# EAGLE design Laser_Array_Temp_V1.2 (EAGLE 7.7.0)
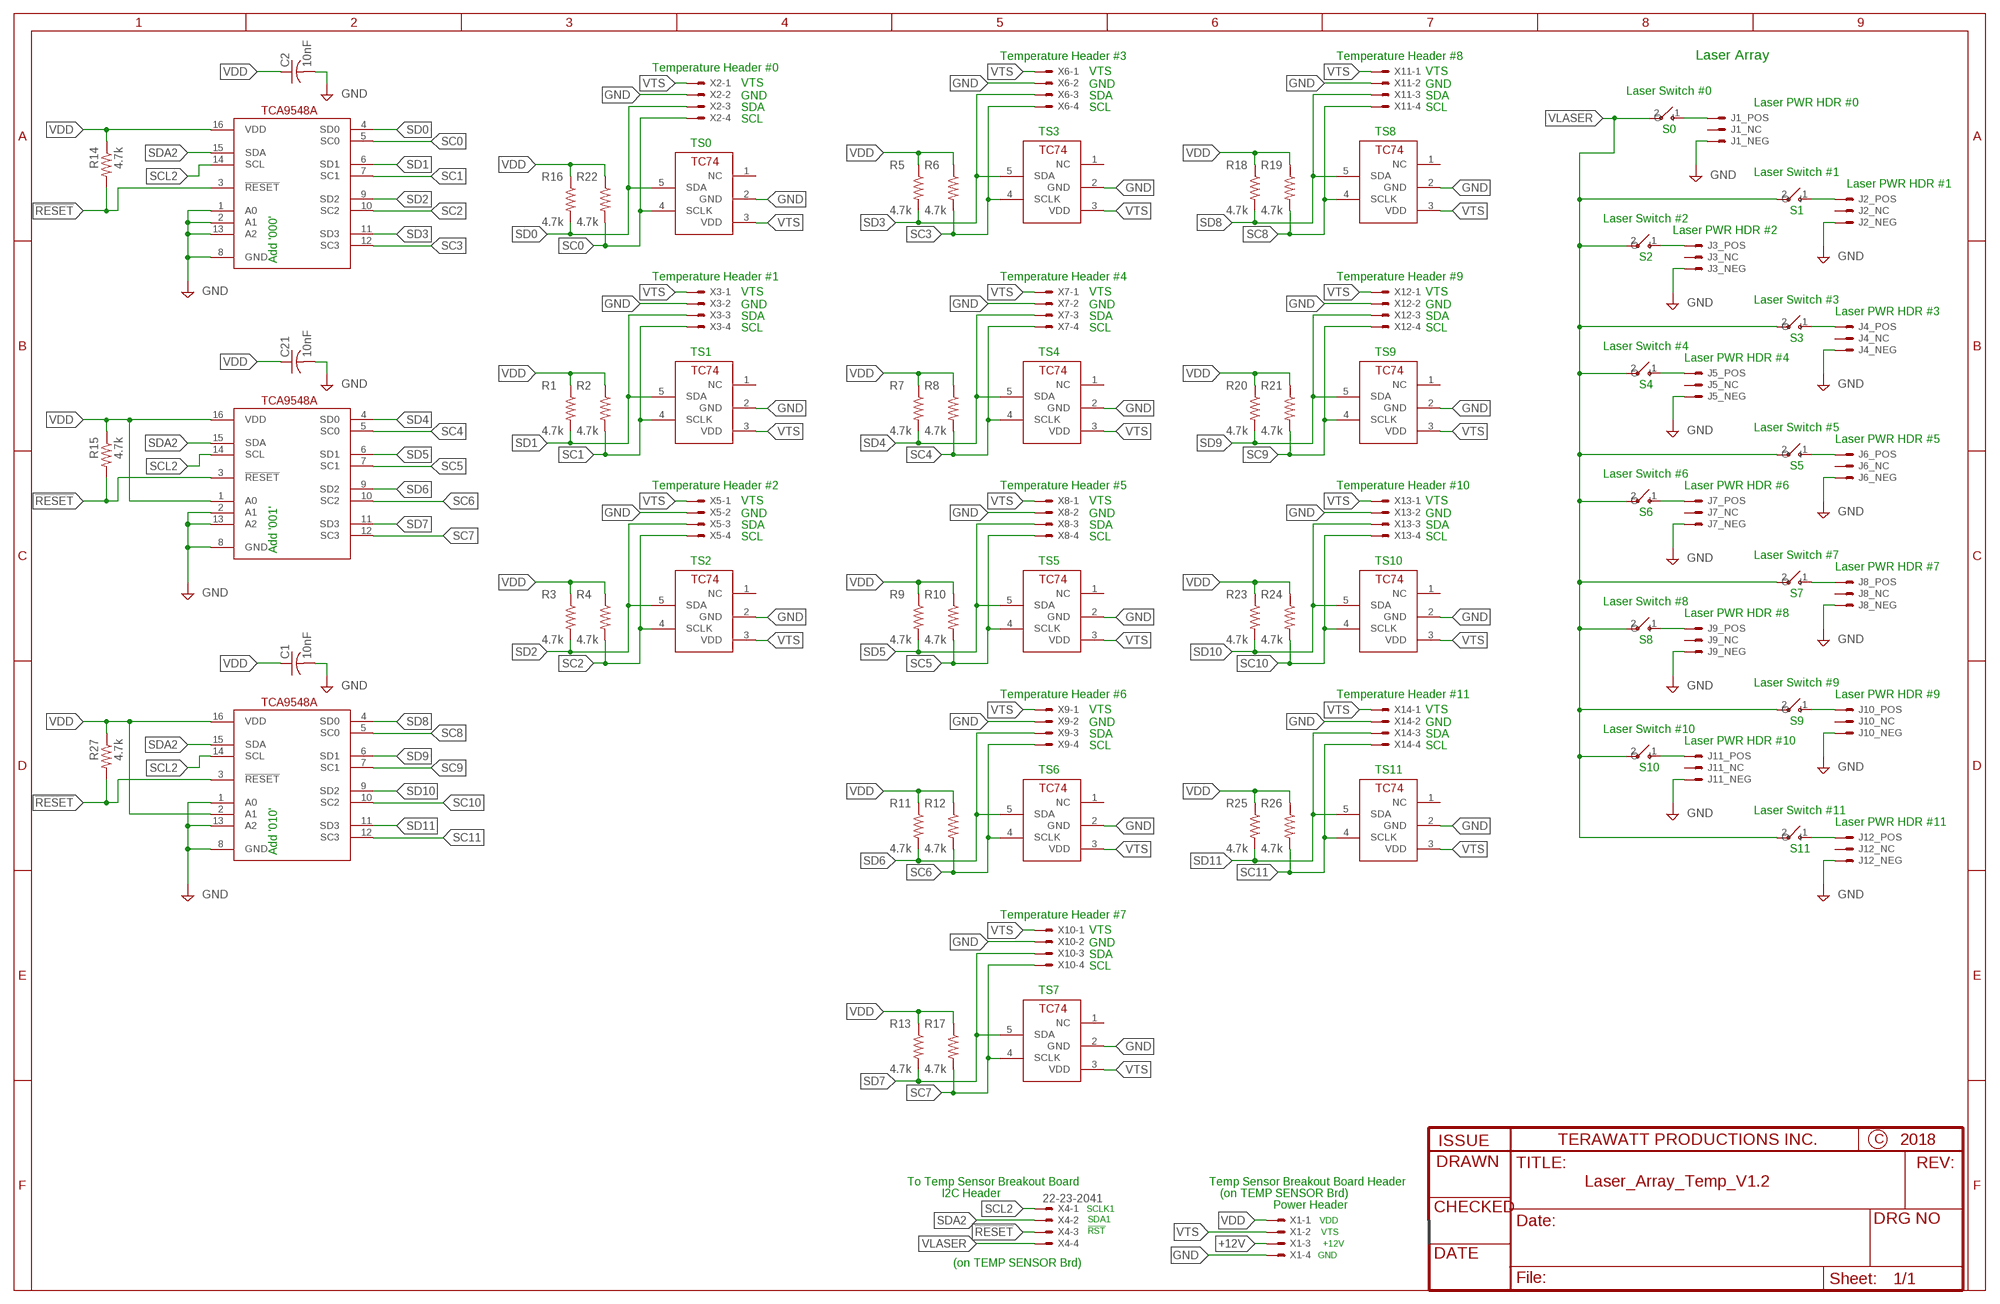
[diagram p0: schematic, sheet 1]

## Parts
C1  10nF  C-USC0805  [C0805]
C2  10nF  C-USC0805  [C0805]
C21  10nF  C-USC0805  [C0805]
J1  LASER_MOD  [LASER_MOD]
J2  LASER_MOD  [LASER_MOD]
J3  LASER_MOD  [LASER_MOD]
J4  LASER_MOD  [LASER_MOD]
J5  LASER_MOD  [LASER_MOD]
J6  LASER_MOD  [LASER_MOD]
J7  LASER_MOD  [LASER_MOD]
J8  LASER_MOD  [LASER_MOD]
J9  LASER_MOD  [LASER_MOD]
J10  LASER_MOD  [LASER_MOD]
J11  LASER_MOD  [LASER_MOD]
J12  LASER_MOD  [LASER_MOD]
R1  4.7k  R-US_M0805  [M0805]
R2  4.7k  R-US_M0805  [M0805]
R3  4.7k  R-US_M0805  [M0805]
R4  4.7k  R-US_M0805  [M0805]
R5  4.7k  R-US_M0805  [M0805]
R6  4.7k  R-US_M0805  [M0805]
R7  4.7k  R-US_M0805  [M0805]
R8  4.7k  R-US_M0805  [M0805]
R9  4.7k  R-US_M0805  [M0805]
R10  4.7k  R-US_M0805  [M0805]
R11  4.7k  R-US_M0805  [M0805]
R12  4.7k  R-US_M0805  [M0805]
R13  4.7k  R-US_M0805  [M0805]
R14  4.7k  R-US_M0805  [M0805]
R15  4.7k  R-US_M0805  [M0805]
R16  4.7k  R-US_M0805  [M0805]
R17  4.7k  R-US_M0805  [M0805]
R18  4.7k  R-US_M0805  [M0805]
R19  4.7k  R-US_M0805  [M0805]
R20  4.7k  R-US_M0805  [M0805]
R21  4.7k  R-US_M0805  [M0805]
R22  4.7k  R-US_M0805  [M0805]
R23  4.7k  R-US_M0805  [M0805]
R24  4.7k  R-US_M0805  [M0805]
R25  4.7k  R-US_M0805  [M0805]
R26  4.7k  R-US_M0805  [M0805]
R27  4.7k  R-US_M0805  [M0805]
S13  TOGGLE_SPST  [22-23-2021]
S14  TOGGLE_SPST  [22-23-2021]
S15  TOGGLE_SPST  [22-23-2021]
S16  TOGGLE_SPST  [22-23-2021]
S17  TOGGLE_SPST  [22-23-2021]
S18  TOGGLE_SPST  [22-23-2021]
S19  TOGGLE_SPST  [22-23-2021]
S20  TOGGLE_SPST  [22-23-2021]
S21  TOGGLE_SPST  [22-23-2021]
S22  TOGGLE_SPST  [22-23-2021]
S23  TOGGLE_SPST  [22-23-2021]
S24  TOGGLE_SPST  [22-23-2021]
TS1  TC74  [SOT23-5L]
TS2  TC74  [SOT23-5L]
TS3  TC74  [SOT23-5L]
TS4  TC74  [SOT23-5L]
TS5  TC74  [SOT23-5L]
TS6  TC74  [SOT23-5L]
TS7  TC74  [SOT23-5L]
TS8  TC74  [SOT23-5L]
TS9  TC74  [SOT23-5L]
TS10  TC74  [SOT23-5L]
TS11  TC74  [SOT23-5L]
TS12  TC74  [SOT23-5L]
U1  TCA9546A  [SOIC16N]
U2  TCA9546A  [SOIC16N]
U3  TCA9546A  [SOIC16N]
X1  22-23-2041  [22-23-2041]
X2  22-23-2041  [22-23-2041]
X3  22-23-2041  [22-23-2041]
X4  22-23-2041  [22-23-2041]
X5  22-23-2041  [22-23-2041]
X6  22-23-2041  [22-23-2041]
X7  22-23-2041  [22-23-2041]
X8  22-23-2041  [22-23-2041]
X9  22-23-2041  [22-23-2041]
X10  22-23-2041  [22-23-2041]
X11  22-23-2041  [22-23-2041]
X12  22-23-2041  [22-23-2041]
X13  22-23-2041  [22-23-2041]
X14  22-23-2041  [22-23-2041]

## Nets
!RESET: R14.2 R15.2 R27.2 U1.3(!RESET) U2.3(!RESET) U3.3(!RESET) X4.3
+12V: X1.3
GND: C1.2 C2.2 C21.2 J1.3 J2.3 J3.3 J4.3 J5.3 J6.3 J7.3 J8.3 J9.3 J10.3 J11.3 J12.3 TS1.2(GND) TS2.2(GND) TS3.2(GND) TS4.2(GND) TS5.2(GND) TS6.2(GND) TS7.2(GND) TS8.2(GND) TS9.2(GND) TS10.2(GND) TS11.2(GND) TS12.2(GND) U1.1(A0) U1.2(A1) U1.8(GND) U1.13(A2) U2.2(A1) U2.8(GND) U2.13(A2) U3.1(A0) U3.8(GND) U3.13(A2) X1.4 X2.2 X3.2 X5.2 X6.2 X7.2 X8.2 X9.2 X10.2 X11.2 X12.2 X13.2 X14.2
N$1: J2.1 S13.1(O)
N$2: J1.1 S16.1(O)
N$3: J3.1 S14.1(O)
N$4: J4.1 S15.1(O)
N$5: J5.1 S17.1(O)
N$6: J6.1 S18.1(O)
N$7: J7.1 S19.1(O)
N$8: J8.1 S20.1(O)
N$9: J9.1 S21.1(O)
N$10: J10.1 S22.1(O)
N$11: J11.1 S23.1(O)
N$12: J12.1 S24.1(O)
SC0: R22.2 TS1.4(SCLK) U1.5(SC0) X2.4
SC1: R2.2 TS2.4(SCLK) U1.7(SC1) X3.4
SC2: R4.2 TS3.4(SCLK) U1.10(SC2) X5.4
SC3: R6.2 TS4.4(SCLK) U1.12(SC3) X6.4
SC4: R8.2 TS5.4(SCLK) U2.5(SC0) X7.4
SC5: R10.2 TS6.4(SCLK) U2.7(SC1) X8.4
SC6: R12.2 TS7.4(SCLK) U2.10(SC2) X9.4
SC7: R17.2 TS8.4(SCLK) U2.12(SC3) X10.4
SC8: R19.2 TS9.4(SCLK) U3.5(SC0) X11.4
SC9: R21.2 TS10.4(SCLK) U3.7(SC1) X12.4
SC10: R24.2 TS11.4(SCLK) U3.10(SC2) X13.4
SC11: R26.2 TS12.4(SCLK) U3.12(SC3) X14.4
SCL2: U1.14(SCL) U2.14(SCL) U3.14(SCL) X4.1
SD0: R16.2 TS1.5(SDA) U1.4(SD0) X2.3
SD1: R1.2 TS2.5(SDA) U1.6(SD1) X3.3
SD2: R3.2 TS3.5(SDA) U1.9(SD2) X5.3
SD3: R5.2 TS4.5(SDA) U1.11(SD3) X6.3
SD4: R7.2 TS5.5(SDA) U2.4(SD0) X7.3
SD5: R9.2 TS6.5(SDA) U2.6(SD1) X8.3
SD6: R11.2 TS7.5(SDA) U2.9(SD2) X9.3
SD7: R13.2 TS8.5(SDA) U2.11(SD3) X10.3
SD8: R18.2 TS9.5(SDA) U3.4(SD0) X11.3
SD9: R20.2 TS10.5(SDA) U3.6(SD1) X12.3
SD10: R23.2 TS11.5(SDA) U3.9(SD2) X13.3
SD11: R25.2 TS12.5(SDA) U3.11(SD3) X14.3
SDA2: U1.15(SDA) U2.15(SDA) U3.15(SDA) X4.2
VDD: C1.1 C2.1 C21.1 R1.1 R2.1 R3.1 R4.1 R5.1 R6.1 R7.1 R8.1 R9.1 R10.1 R11.1 R12.1 R13.1 R14.1 R15.1 R16.1 R17.1 R18.1 R19.1 R20.1 R21.1 R22.1 R23.1 R24.1 R25.1 R26.1 R27.1 U1.16(VDD) U2.1(A0) U2.16(VDD) U3.2(A1) U3.16(VDD) X1.1
VLASER: S13.2(I) S14.2(I) S15.2(I) S16.2(I) S17.2(I) S18.2(I) S19.2(I) S20.2(I) S21.2(I) S22.2(I) S23.2(I) S24.2(I) X4.4
VTS: TS1.3(VDD) TS2.3(VDD) TS3.3(VDD) TS4.3(VDD) TS5.3(VDD) TS6.3(VDD) TS7.3(VDD) TS8.3(VDD) TS9.3(VDD) TS10.3(VDD) TS11.3(VDD) TS12.3(VDD) X1.2 X2.1 X3.1 X5.1 X6.1 X7.1 X8.1 X9.1 X10.1 X11.1 X12.1 X13.1 X14.1
Unconnected: J1.2 J2.2 J3.2 J4.2 J5.2 J6.2 J7.2 J8.2 J9.2 J10.2 J11.2 J12.2 TS1.1(NC) TS2.1(NC) TS3.1(NC) TS4.1(NC) TS5.1(NC) TS6.1(NC) TS7.1(NC) TS8.1(NC) TS9.1(NC) TS10.1(NC) TS11.1(NC) TS12.1(NC)

## Notes on the sheet
- Temperature Header #3 | Temperature Header #8 | Laser Array
- Temperature Header #0
- VTS | VTS
- VTS | GND | GND
- Laser Switch #0
- GND | SDA | SDA
- Laser PWR HDR #0
- SDA | SCL | SCL
- SCL
- TS3 | TS8 | S0
- TS0
- Laser Switch #1
- Laser PWR HDR #1
- S1
- Laser Switch #2
- Laser PWR HDR #2
- Add '000' | S2
- Temperature Header #1 | Temperature Header #4 | Temperature Header #9
- VTS | VTS | VTS
- Laser Switch #3
- GND | GND | GND
- Laser PWR HDR #3
- SDA | SDA | SDA
- SCL | SCL | SCL
- S3
- Laser Switch #4
- TS1 | TS4 | TS9
- Laser PWR HDR #4
- S4
- Laser Switch #5
- Laser PWR HDR #5
- S5
- Laser Switch #6
- Temperature Header #2 | Temperature Header #5 | Temperature Header #10 | Laser PWR HDR #6
- VTS | VTS | VTS
- GND | GND | GND | S6
- SDA | SDA | SDA
- SCL | SCL | SCL
- Add '001'
- Laser Switch #7
- TS2 | TS5 | TS10
- Laser PWR HDR #7
- S7
- Laser Switch #8
- Laser PWR HDR #8
- S8
- Laser Switch #9
- Temperature Header #6 | Temperature Header #11 | Laser PWR HDR #9
- VTS | VTS
- GND | GND | S9
- Laser Switch #10
- SDA | SDA
- Laser PWR HDR #10
- SCL | SCL
- TS6 | TS11 | S10
- Laser Switch #11
- Laser PWR HDR #11
- Add '010' | S11
- Temperature Header #7
- VTS
- GND
- SDA
- SCL
- TS7
- To Temp Sensor Breakout Board | Temp Sensor Breakout Board Header
- I2C Header | (on TEMP SENSOR Brd)
- Power Header
- SCLK1
- SDA1 | VDD
- !RST | VTS
- +12V
- GND
- (on TEMP SENSOR Brd)

## Library data of the parts
C1 C2 C21 = rcl:C-US: CAPACITOR, American symbol
J1-J12 = Mine:LASER_MOD
R1-R27 = rcl:R-US_: RESISTOR, American symbol
S13-S24 = Mine:TOGGLE_SPST: SPST Toggle SPST toggle switch with no package
TS1-TS12 = Mine:TC74
U1-U3 = Mine:TCA9546A
X1-X14 = Mine:22-23-2041: .100" (2.54mm) Center Header - 4 Pin; MF: MOLEX; MPN: 22-23-2041; OC_FARNELL: 1462920; OC_NEWARK: 38C0355

## Net classes
0 default: width 0.254 mm, drill 0.508 mm, clearance 0.203 mm

## Board
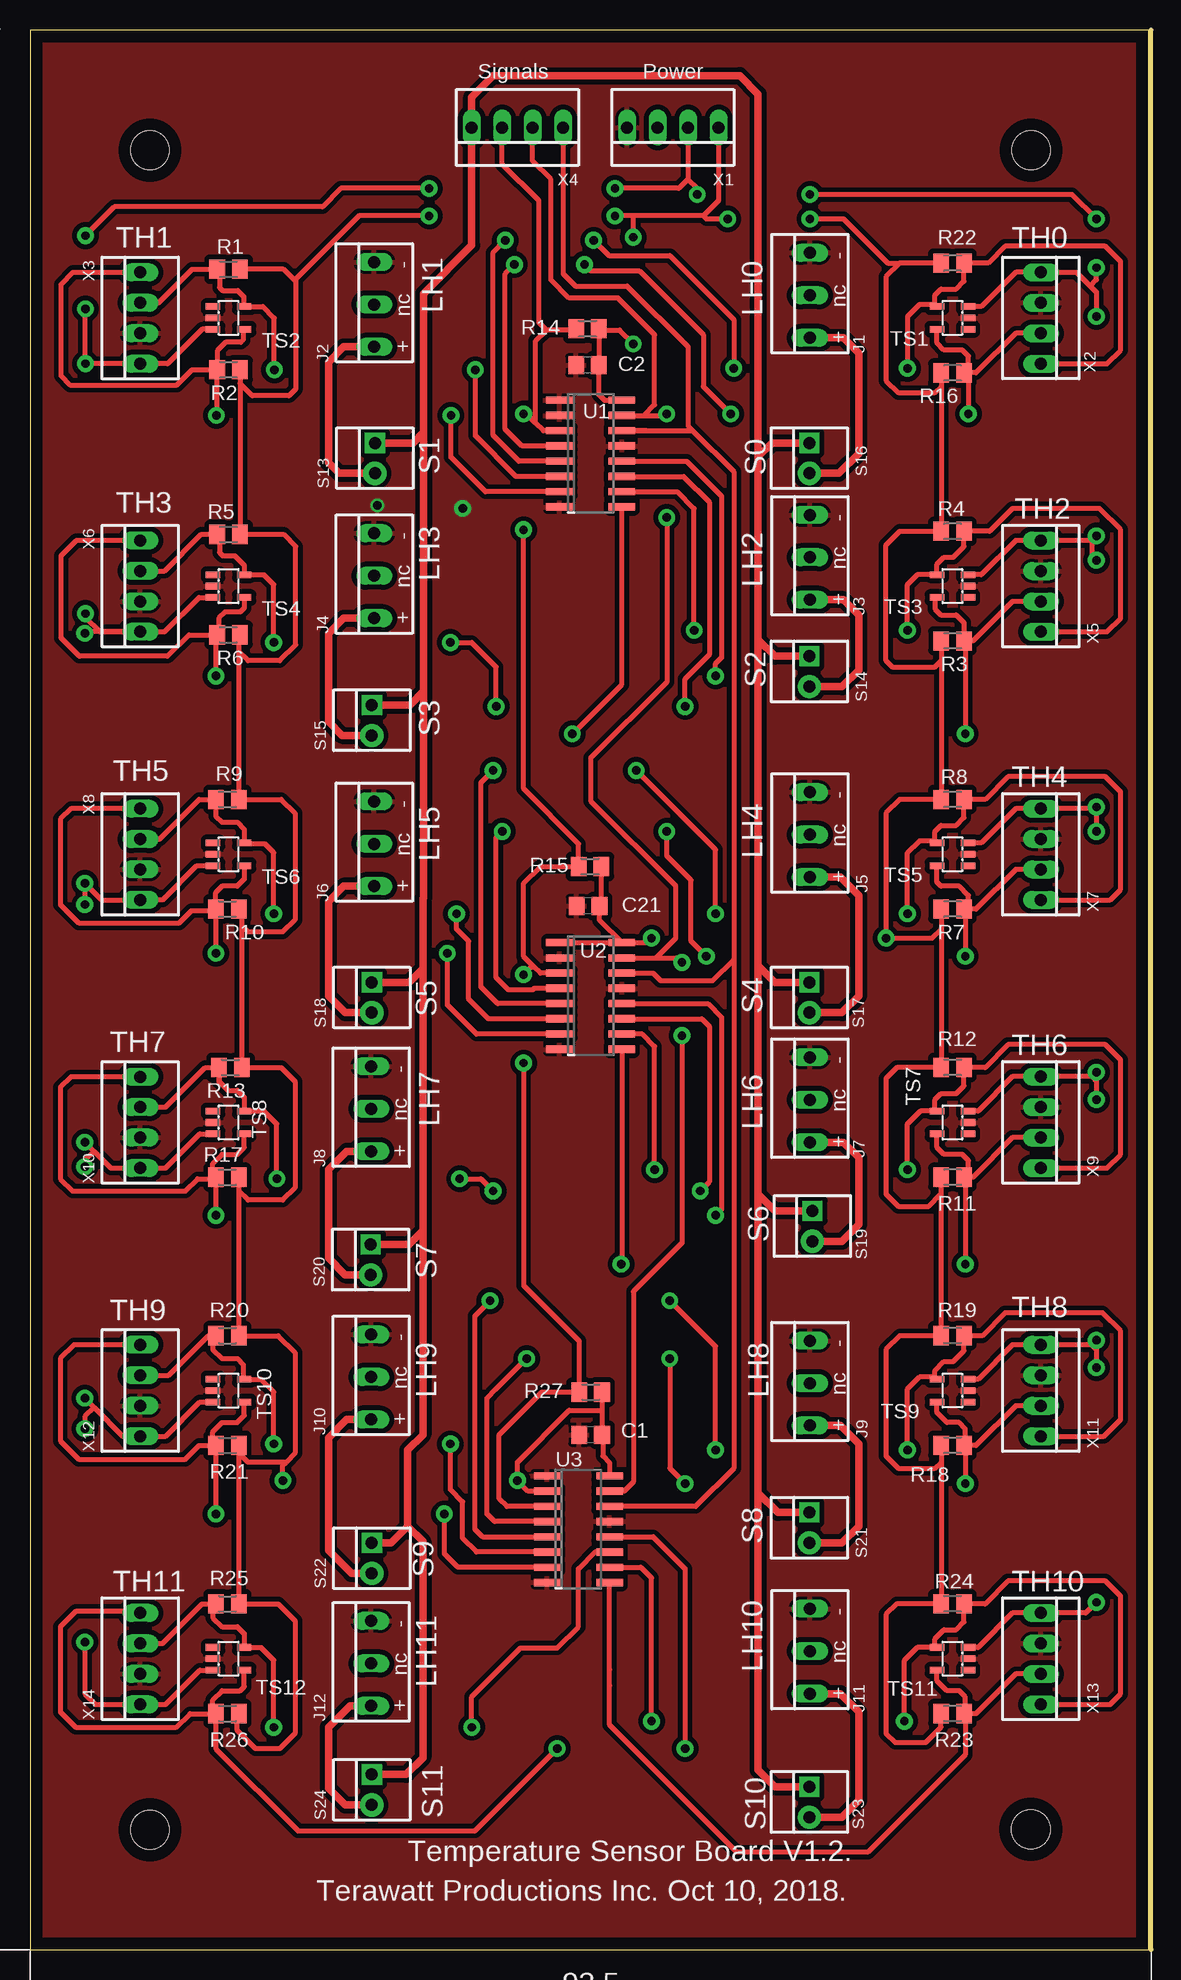
[diagram p1: board, top side]
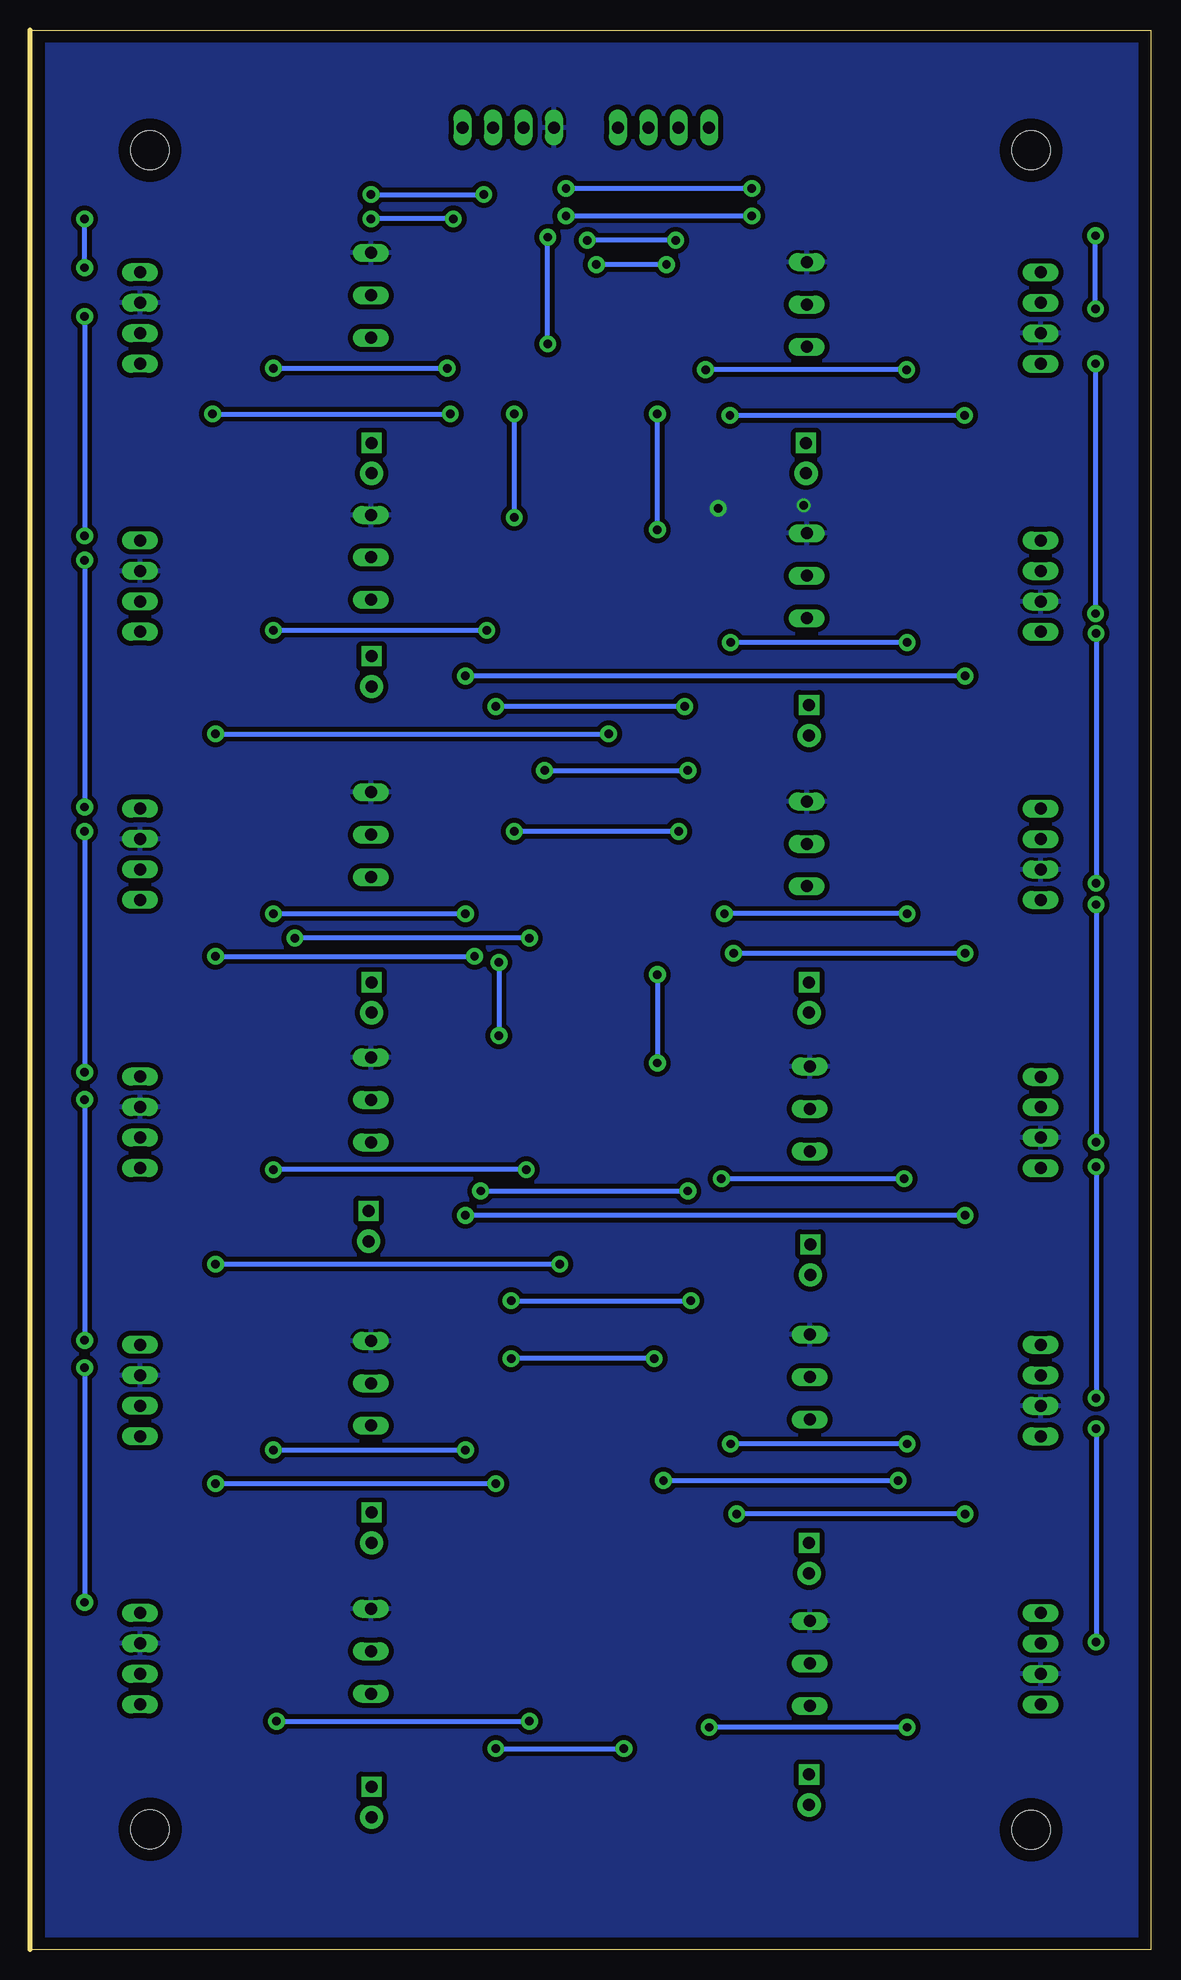
[diagram p2: board, bottom side, seen from below]

Size 93.45 x 160.02 mm. Coordinates in mm from the lower left corner, seen from the top.
Outline: 0,0 93.45,0 93.45,160.02 0,160.02 0,0
Copper layers (1*16): Top 0.035mm / dielectric 1.5mm / Bottom 0.035mm
Design rules "default *": minimum track width 10mil, minimum drill 24mil, track to track 16mil, track to pad 14mil, pad to pad 14mil, via to via 14mil, smd to smd 14mil, copper to edge 40mil, drill to drill 8mil, minimum pad ring 10mil, minimum via ring 8mil, stop-mask expansion 4mil, vias tented up to drill 0mil, thermal gap 10mil
Holes 3.2 mm at 10,10 10,150 83.44,10.04 83.46,150

### Footprints (pad centres in the part's own frame; a part is rotated, then mirrored left to right if it is on the bottom)
C0805 = smd 1.3 x 1.5: 1 -0.95,0; 2 0.95,0
LASER_MOD = drill 1 long: 1 -2.54,0; 2 1,0; 3 4.54,0
M0805 = smd 1.3 x 1.6: 1 -0.95,0; 2 0.95,0
22-23-2021 = drill 1 pad 1.93: 1 -1.27,0 | drill 1 pad 1.676 square: 2 1.27,0
SOT23-5L = smd 0.55 x 1.2: 1 -0.95,-1.3; 2 0,-1.3; 3 0.95,-1.3; 4 0.95,1.3; 5 -0.95,1.3
SOIC16N = smd 0.6 x 2.2: 1 -4.445,-2.6; 2 -3.175,-2.6; 3 -1.905,-2.6; 4 -0.635,-2.6; 5 0.635,-2.6; 6 1.905,-2.6; 7 3.175,-2.6; 8 4.445,-2.6; 9 4.445,2.6; 10 3.175,2.6; 11 1.905,2.6; 12 0.635,2.6; 13 -0.635,2.6; 14 -1.905,2.6; 15 -3.175,2.6; 16 -4.445,2.6
22-23-2041 = drill 1 long: 1 -3.81,0; 2 -1.27,0; 3 1.27,0; 4 3.81,0

### Placement (x,y rotation side)
C1  46.74,42.93 180 top
C2  46.48,132.08 180 top
C21  46.53,86.99 180 top
J1  65.02,136.91 90 top
J2  28.7,136.14 90 top
J3  65.02,115.06 90 top
J4  28.7,113.54 90 top
J5  65.02,91.95 90 top
J6  28.7,91.19 90 top
J7  65.02,69.85 90 top
J8  28.45,69.09 90 top
J9  65.02,46.23 90 top
J10  28.45,46.74 90 top
J11  65.02,23.88 90 top
J12  28.45,22.86 90 top
R1  16.56,140.08 180 top
R2  16.56,131.7 180 top
R3  76.91,109.09 0 top
R4  76.91,118.24 0 top
R5  16.56,117.98 180 top
R6  16.56,109.6 180 top
R7  76.91,86.74 0 top
R8  76.91,95.89 0 top
R9  16.46,95.89 180 top
R10  16.46,86.74 180 top
R11  76.91,64.39 0 top
R12  76.91,73.53 0 top
R13  16.72,73.53 180 top
R14  46.48,135.13 180 top
R15  46.69,90.3 180 top
R16  76.91,131.44 0 top
R17  16.46,64.39 180 top
R18  76.91,42.04 0 top
R19  76.91,51.18 0 top
R20  16.46,51.18 180 top
R21  16.46,42.04 180 top
R22  76.91,140.59 0 top
R23  76.91,19.68 0 top
R24  76.91,28.83 0 top
R25  16.46,28.83 180 top
R26  16.46,19.69 180 top
R27  46.74,46.48 180 top
S13  28.75,124.33 90 top
S14  64.97,106.55 90 top
S15  28.5,102.49 90 top
S16  64.97,124.33 90 top
S17  64.97,79.38 90 top
S18  28.5,79.37 90 top
S19  65.23,60.33 90 top
S20  28.4,57.53 90 top
S21  64.97,35.18 90 top
S22  28.5,32.64 90 top
S23  64.97,12.32 90 top
S24  28.5,13.33 90 top
TS1  76.91,136.02 90 top
TS2  16.56,136.02 270 top
TS3  76.91,113.67 90 top
TS4  16.56,113.66 270 top
TS5  76.91,91.31 90 top
TS6  16.56,91.31 270 top
TS7  76.91,68.96 90 top
TS8  16.56,68.96 270 top
TS9  76.91,46.61 90 top
TS10  16.56,46.61 270 top
TS11  76.91,24.26 90 top
TS12  16.56,24.26 270 top
U1  46.74,124.71 270 top
U2  46.74,79.5 270 top
U3  45.72,35.05 270 top
X1  53.59,151.89 180 top
X2  84.28,136.02 270 top
X3  9.19,136.02 90 top
X4  40.64,151.89 180 top
X5  84.28,113.67 270 top
X6  9.19,113.66 90 top
X7  84.28,91.31 270 top
X8  9.19,91.31 90 top
X9  84.28,68.96 270 top
X10  9.19,68.96 90 top
X11  84.28,46.61 270 top
X12  9.19,46.61 90 top
X13  84.28,24.26 270 top
X14  9.19,24.26 90 top

### Tracks (layer width: path | path; a pad name or v marks a point on that pad's centre or on a via)
!RESET  (via drill 0.7 pad 1.4)
  Top 0.406: U1.3 42.8,126.62 42.16,127.25 | 42.16,127.25 42.16,134.11 43.05,135 | R14.2 45.41,135 43.05,135 | 42.16,127.25 41.4,128.02 v41.15,128.02 | 43.05,135 42.42,135.64 42.42,145.8 39.37,148.84 X4.3 | U2.3 42.55,81.41 42.04,81.92 | 42.04,81.92 41.15,82.8 41.15,88.9 42.55,90.3 R15.2 45.74,92.18 41.15,96.77 v41.15,118.36 | v41.15,73.91 41.15,55.37 45.79,50.73 R27.2 42.67,46.48 39.12,42.93 39.12,37.59 39.75,36.96 U3.3 | v41.15,81.28 41.78,81.92 42.04,81.92
  Bottom 0.406: v41.15,118.36 v41.15,128.02 | v41.15,81.28 v41.15,73.91
GND  (via drill 0.7, 0.7 pad 1.4)
  other vias: 28.96,120.4 36.07,120.14
  pour Top: 0,160.1 93.47,159.84 93.47,-0.25 0,0
  pour Bottom: 0,160.1 94.23,159.84 94.23,-0.25 0.25,0
N$1
  Top 0.61: S13.1 25.78,123.06 24.89,123.95 24.89,132.33 26.16,133.6 J2.1
N$2
  Top 0.61: S16.1 67.44,123.06 69.09,124.71 69.09,133.1 67.82,134.37 J1.1
N$3
  Top 0.61: S14.1 67.69,105.28 69.09,106.68 69.09,111.25 67.82,112.52 J3.1
N$4
  Top 0.61: S15.1 26.04,101.22 24.89,102.36 24.89,109.73 26.16,111 J4.1
N$5
  Top 0.61: S17.1 67.69,78.11 69.09,79.5 69.09,87.88 67.56,89.41 J5.1
N$6
  Top 0.61: S18.1 26.29,78.1 24.89,79.5 24.89,87.38 26.16,88.65 J6.1
N$7
  Top 0.61: S19.1 67.69,59.05 69.09,60.45 69.09,66.04 67.82,67.31 J7.1
N$8
  Top 0.61: S20.1 26.29,56.26 24.89,57.66 24.89,65.02 26.42,66.55 J8.1
N$9
  Top 0.61: S21.1 67.69,33.91 69.09,35.31 69.09,42.16 67.56,43.69 J9.1
N$10
  Top 0.61: S22.1 26.8,31.37 24.89,33.27 24.89,42.67 26.42,44.2 J10.1
N$11
  Top 0.61: S23.1 67.69,11.05 69.09,12.45 69.09,19.81 67.56,21.34 J11.1
N$12
  Top 0.61: S24.1 26.29,12.06 24.89,13.46 24.89,18.54 26.67,20.32 J12.1
SC0  (via drill 0.7 pad 1.4)
  Top 0.406: TS1.4 75.44,137.14 | 75.44,137.14 75.44,137.92 75.95,138.43 77.22,138.43 77.86,139.07 R22.2 79.88,140.59 81.28,141.99 89.66,141.99 90.93,140.72 90.93,133.35 89.79,132.21 X2.4 | 75.44,137.14 74.15,137.14 73.15,136.14 v73.15,131.83 | U1.5 40.77,124.08 38.61,126.24 38.61,141.48 v39.62,142.49 | v46.99,142.49 48.26,141.22 53.34,141.22 58.67,135.89 v58.67,131.83
  Bottom 0.406: v73.15,131.83 v58.67,131.83 | v39.62,142.49 v46.99,142.49
SC1  (via drill 0.7 pad 1.4)
  Top 0.406: TS2.4 17.76,134.97 17.76,134.17 17.57,133.98 16.3,133.98 15.61,133.29 R2.2 | R2.2 15.8,131.76 15.54,131.51 v15.54,127.89 | X3.4 3.6,139.83 2.59,138.81 2.59,131.19 3.35,130.43 12.24,130.43 13.51,131.7 R2.2 | U1.7 37.97,121.54 35.1,124.41 v35.1,127.89
  Bottom 0.406: v15.54,127.89 v35.1,127.89
SC2  (via drill 0.7 pad 1.4)
  Top 0.406: X5.4 89.79,109.86 90.93,111 90.93,118.36 89.15,120.14 81.92,120.14 80.01,118.24 R4.2 77.86,116.98 76.96,116.08 76.2,116.08 75.61,115.49 TS3.4 73.97,114.61 73.15,113.79 v73.15,109.98 | U1.10 53.98,121.54 55.37,120.14 v55.37,109.98
  Bottom 0.406: v73.15,109.98 v55.37,109.98
SC3  (via drill 0.7 pad 1.4)
  Top 0.406: X6.4 3.86,117.47 2.59,116.2 2.59,109.35 4.11,107.82 11.48,107.82 13.26,109.6 R6.2 15.75,109.74 | 15.75,109.74 15.75,111 16.26,111.51 17.53,111.51 17.86,111.84 TS4.4 | 15.75,109.74 15.75,109.22 15.49,108.97 v15.49,106.17 | U1.12 54.74,124.08 57.66,121.16 57.66,107.7 57.15,107.19 v57.15,106.17
  Bottom 0.406: v15.49,106.17 v57.15,106.17
SC4  (via drill 0.7 pad 1.4)
  Top 0.406: TS5.4 75.44,92.44 | 75.44,92.44 75.44,93.22 75.95,93.73 77.22,93.73 77.86,94.37 R8.2 79.63,95.89 81.53,97.79 89.66,97.79 90.93,96.52 90.93,88.39 90.04,87.5 X7.4 | 75.44,92.44 74.15,92.44 73.15,91.44 v73.15,86.36 | U2.5 38.99,78.87 37.59,80.26 37.59,97.28 v38.61,98.3 | 50.55,98.04 v50.55,98.3 57.15,91.69 v57.15,86.36
  Bottom 0.406: v73.15,86.36 v57.15,86.36 | v50.55,98.3 v38.61,98.3
SC5  (via drill 0.7 pad 1.4)
  Top 0.406: X8.4 3.43,95.12 2.54,94.23 2.54,87.12 4.06,85.6 12.45,85.6 13.46,86.61 15.38,86.61 R10.2 15.49,86.76 | 15.49,86.76 15.49,88.14 16,88.65 17.27,88.65 17.86,89.23 TS6.4 | 15.49,86.76 v15.49,83.06 | U2.7 37.21,76.33 34.8,78.74 v34.8,83.06
  Bottom 0.406: v15.49,83.06 v34.8,83.06
SC6  (via drill 0.7 pad 1.4)
  Top 0.406: X9.4 89.79,65.15 90.93,66.29 90.93,74.17 89.66,75.44 81.53,75.44 79.63,73.53 R12.2 77.86,72.02 77.22,71.37 75.95,71.37 75.44,70.87 75.44,70.08 TS7.4 74.23,69.91 73.15,68.83 v73.15,65.02 | U2.10 51.05,76.33 52.07,75.31 v52.07,65.02
  Bottom 0.406: v52.07,65.02 v73.15,65.02
SC7  (via drill 0.7 pad 1.4)
  Top 0.406: X10.4 3.43,72.77 2.54,71.88 2.54,64.26 3.56,63.25 12.95,63.25 13.97,64.26 15.38,64.26 R17.2 | R17.2 15.24,64.66 15.24,65.53 16,66.29 17.27,66.29 17.86,66.88 TS8.4 | R17.2 15.49,64.37 v15.49,61.21 | U2.12 56.52,78.87 57.66,77.72 57.66,61.72 v57.15,61.21
  Bottom 0.406: v15.49,61.21 v57.15,61.21
SC8  (via drill 0.7 pad 1.4)
  Top 0.406: TS9.4 75.44,47.73 | 75.44,47.73 75.44,48.26 76.2,49.02 76.96,49.02 77.86,49.92 R19.2 79.38,51.18 81.28,53.09 89.41,53.09 90.93,51.56 90.93,44.2 89.53,42.8 X11.4 | 75.44,47.73 74.15,47.73 73.15,46.74 v73.15,41.66 | v53.34,54.1 57.15,50.29 v57.15,41.66 | U3.5 37.72,34.42 37.08,35.05 37.08,52.83 v38.35,54.1
  Bottom 0.406: v73.15,41.66 v57.15,41.66 | v53.34,54.1 v38.35,54.1
SC9  (via drill 0.7 pad 1.4)
  Top 0.406: X12.4 3.68,50.42 2.54,49.28 2.54,42.42 4.06,40.89 12.95,40.89 14.1,42.04 R21.2 | R21.2 15.24,42.31 15.24,43.18 16,43.94 17.27,43.94 17.86,44.53 TS10.4 | R21.2 15.49,42.02 v15.49,36.32 | U3.7 35.69,31.88 34.54,33.02 v34.54,36.32
  Bottom 0.406: v15.49,36.32 v34.54,36.32
SC10  (via drill 0.7 pad 1.4)
  Top 0.406: X13.4 90.04,20.45 90.93,21.34 90.93,29.46 89.66,30.73 81.53,30.73 79.63,28.83 R24.2 77.86,27.32 77.22,26.67 76.2,26.67 75.44,25.91 75.44,25.38 TS11.4 73.97,25.21 72.9,24.13 v72.9,19.05 | U3.10 50.93,31.88 51.82,30.99 v51.82,19.05
  Bottom 0.406: v72.9,19.05 v51.82,19.05
SC11  (via drill 0.7 pad 1.4)
  Top 0.406: X14.4 9.06,28.19 3.81,28.19 2.54,26.92 2.54,19.81 3.81,18.54 12.19,18.54 13.34,19.69 R26.2 | R26.2 15.24,19.96 15.24,20.83 16,21.59 17.53,21.59 17.86,21.92 TS12.4 | R26.2 15.49,19.67 15.49,16.76 22.35,9.91 37.08,9.91 v43.94,16.76 | U3.12 51.94,34.42 54.61,31.75 v54.61,16.76
  Bottom 0.406: v54.61,16.76 v43.94,16.76
SCL2
  Top 0.406: X4.1 44.45,139.7 45.47,138.68 49.78,138.68 54.86,133.6 54.86,127 55.24,126.62 | 51.44,126.62 U1.14 55.24,126.62 | 55.24,126.62 58.67,123.19 58.67,82.55 | U2.14 51.94,81.41 52.58,80.77 56.9,80.77 58.67,82.55 | 58.67,82.55 58.67,40.13 55.5,36.96 U3.14
SD0  (via drill 0.7 pad 1.4)
  Top 0.406: R16.2 78.23,131.82 78.23,132.84 77.72,133.35 76.2,133.35 75.61,133.94 TS1.5 | X2.3 82.17,134.75 78.87,131.44 R16.2 | R16.2 78.23,131.07 v78.23,128.02 | U1.4 41.02,125.35 39.62,126.75 39.62,139.7 v40.39,140.46 | v58.42,128.02 56.13,130.3 56.13,134.62 50.8,139.95 46.74,139.95 v46.23,140.46
  Bottom 0.406: v78.23,128.02 v58.42,128.02 | v40.39,140.46 v46.23,140.46
SD1  (via drill 0.7 pad 1.4)
  Top 0.406: X3.3 10.72,137.29 13.51,140.08 R1.2 15.8,139.89 15.8,138.56 16.05,138.3 17.32,138.3 17.83,137.79 17.83,137 TS2.5 19.42,136.97 20.37,136.02 v20.37,131.7 | U1.6 40.51,122.81 37.13,126.19 v37.13,131.7
  Bottom 0.406: v20.37,131.7 v37.13,131.7
SD2  (via drill 0.7 pad 1.4)
  Top 0.406: X5.3 81.92,112.39 78.61,109.09 R3.2 | TS3.5 75.44,112.54 75.44,111.76 75.95,111.25 77.22,111.25 77.86,110.61 R3.2 | R3.2 77.98,108.98 v77.98,101.35 | U1.9 49.34,105.92 49.34,105.72 49.34,105.47 v45.21,101.35
  Bottom 0.406: v77.98,101.35 v45.21,101.35
SD3  (via drill 0.7 pad 1.4)
  Top 0.406: X6.3 11.22,114.93 14.27,117.98 R5.2 16.05,117.66 15.8,117.41 15.8,116.46 16.05,116.2 17.07,116.2 17.86,115.41 TS4.5 19.5,114.61 20.32,113.79 v20.32,108.97 | U1.11 54.48,122.81 56.64,120.65 56.64,107.95 54.61,105.92 v54.61,103.63 | v38.86,103.63 38.86,106.93 36.83,108.97 v35.05,108.97
  Bottom 0.406: v20.32,108.97 v35.05,108.97 | v38.86,103.63 v54.61,103.63
SD4  (via drill 0.7 pad 1.4)
  Top 0.406: X7.3 82.17,90.04 78.87,86.74 R7.2 | R7.2 78.23,87.11 78.23,87.88 77.47,88.65 75.95,88.65 75.61,88.98 TS5.5 | R7.2 77.98,86.62 v77.98,82.8 | U2.4 42.04,80.14 41.91,80.01 39.88,80.01 38.86,81.03 38.86,92.71 v39.37,93.22 | v56.39,82.8 55.12,84.07 55.12,89.15 53.09,91.19 v53.09,93.22
  Bottom 0.406: v77.98,82.8 v56.39,82.8 | v39.37,93.22 v53.09,93.22
SD5  (via drill 0.7 pad 1.4)
  Top 0.406: X8.3 10.79,92.58 14.1,95.89 R9.2 15.49,95.87 15.49,94.49 16,93.98 17.27,93.98 17.86,93.39 17.86,92.28 | 17.86,92.28 TS6.5 | 17.86,92.28 17.78,92.2 19.56,92.2 20.32,91.44 v20.32,86.36 | U2.6 38.23,77.6 36.58,79.25 36.58,84.07 35.56,85.09 v35.56,86.36
  Bottom 0.406: v20.32,86.36 v35.56,86.36
SD6  (via drill 0.7 pad 1.4)
  Top 0.406: R11.2 78.23,64.76 78.23,65.79 77.72,66.29 76.2,66.29 75.61,66.88 TS7.5 | X9.3 81.92,67.69 78.61,64.39 R11.2 | R11.2 77.98,64.27 v77.98,57.15 | U2.9 49.34,57.21 v49.28,57.15
  Bottom 0.406: v77.98,57.15 v49.28,57.15
SD7  (via drill 0.7 pad 1.4)
  Top 0.406: X10.3 11.3,70.23 14.61,73.53 R13.2 | R13.2 15.75,73.52 15.75,72.39 15.77,72.37 | R13.2 15.77,72.37 | 15.77,72.37 16.51,71.63 17.27,71.63 17.86,71.04 TS8.5 19.5,69.91 20.57,68.83 v20.57,64.26 | U2.11 56.01,77.6 56.64,76.96 56.64,64.01 v55.88,63.25 | v35.81,64.26 37.59,64.26 v38.61,63.25
  Bottom 0.406: v20.57,64.26 v35.81,64.26 | v55.88,63.25 v38.61,63.25
SD8  (via drill 0.7 pad 1.4)
  Top 0.406: R18.2 77.98,42.15 77.98,43.43 77.47,43.94 76.45,43.94 75.61,44.78 TS9.5 | X11.3 82.17,45.34 78.87,42.04 R18.2 | R18.2 77.98,41.92 v77.98,38.86 | U3.4 38.73,35.69 38.1,36.32 38.1,45.97 38.86,46.74 39.62,47.5 v41.4,49.28 | v53.34,49.28 53.34,40.13 v54.61,38.86
  Bottom 0.406: v77.98,38.86 v54.61,38.86 | v41.4,49.28 v53.34,49.28
SD9  (via drill 0.7 pad 1.4)
  Top 0.406: X12.3 11.56,47.88 14.86,51.18 R20.2 15.24,50.91 15.24,50.04 16,49.28 17.27,49.28 17.78,48.77 17.78,47.64 TS10.5 19.24,47.56 20.32,46.48 v20.32,42.16 | U3.6 37.21,33.15 36.07,34.29 36.07,37.34 35.05,38.35 v35.05,42.16
  Bottom 0.406: v20.32,42.16 v35.05,42.16
SD10
  Top 0.406: R23.2 77.98,19.8 77.98,21.08 77.47,21.59 76.45,21.59 75.61,22.43 TS11.5 | X13.3 82.17,22.99 78.87,19.68 R23.2 | R23.2 77.98,19.57 77.98,16.26 69.85,8.13 58.93,8.13 48.32,18.74 48.32,22.04 48.32,23.37 U3.9
SD11  (via drill 0.7 pad 1.4)
  Top 0.406: X14.3 11.05,25.53 14.35,28.83 R25.2 15.24,28.56 15.24,27.69 16,26.92 17.27,26.92 17.86,26.34 TS12.5 19.24,25.21 20.32,24.13 v20.32,18.54 | U3.11 47.12,33.15 45.72,31.75 45.72,26.92 43.94,25.15 40.89,25.15 36.83,21.08 v36.83,18.54
  Bottom 0.406: v20.32,18.54 v36.83,18.54
SDA2  (via drill 0.7 pad 1.4)
  Top 0.406: X4.2 41.91,149.1 43.43,147.57 43.43,139.19 44.96,137.67 49.02,137.67 52.07,134.62 52.07,128.78 51.18,127.89 U1.15 52.96,127.89 v53.09,128.02 | U3.15 49.53,38.23 50.29,38.99 50.29,54.86 54.36,58.93 v54.36,76.2 | v53.09,119.38 53.09,105.66 46.74,99.31 46.74,95.76 53.85,88.65 53.85,84.33 52.2,82.68 U2.15 53.98,82.68 v54.36,82.3
  Bottom 0.406: v53.09,128.02 v53.09,119.38 | v54.36,82.3 v54.36,76.2
VDD  (via drill 0.7 pad 1.4)
  Top 0.406: R2.1 17.83,131.7 17.51,131.38 17.51,130.56 | 22.06,139.15 22.15,139.06 22.15,130.1 21.59,129.54 18.52,129.54 17.51,130.56 | 22.06,139.15 21.13,140.08 R1.1 | R6.1 17.41,109.5 17.41,108.2 | 17.41,108.2 R9.1 20.95,95.89 22.1,94.74 22.1,85.85 21.08,84.84 18.17,84.84 17.67,85.34 | R10.1 17.67,86.49 17.67,85.34 | 17.67,85.34 R13.1 20.95,73.53 22.1,72.39 22.1,63.5 21.08,62.48 18.17,62.48 17.41,63.25 | R17.1 17.41,63.25 | 17.41,63.25 R20.1 20.7,51.18 22.1,49.78 22.1,41.4 21.34,40.64 | U1.16 47.88,129.16 47.43,129.61 C2.1 R14.1 47.56,135 49.15,135 v50.29,133.86 | 50.29,144.53 v48.77,144.53 | v33.27,144.53 27.43,144.53 22.06,139.15 | v50.29,142.75 50.29,144.53 | R21.1 17.41,41.4 | 17.41,41.4 R25.1 20.7,28.83 22.1,27.43 22.1,18.03 20.83,16.76 18.8,16.76 17.27,18.29 17.27,19.55 R26.1 | R22.1 72.52,140.59 | 72.52,140.59 71.37,139.45 71.37,130.81 72.39,129.79 75.45,129.79 75.96,130.3 | R16.1 75.96,130.3 | 75.96,130.3 R4.1 72.52,118.24 71.37,117.09 71.37,107.44 71.88,106.93 75.45,106.93 75.96,107.44 | R3.1 75.96,107.44 | 75.96,107.44 R8.1 72.52,95.89 71.37,94.74 71.37,84.58 | 71.37,84.58 v71.37,84.33 | R7.1 75.96,85.09 | 75.96,85.09 R12.1 72.26,73.53 71.37,72.64 71.37,62.99 72.39,61.98 74.93,61.98 75.95,62.99 | R11.1 75.95,64.37 75.95,62.99 | 75.95,62.99 75.95,51.56 75.96,51.55 R19.1 72.52,51.18 71.37,50.04 71.37,41.15 72.39,40.13 75.45,40.13 75.96,40.64 | R18.1 75.96,40.64 | 75.96,40.64 R24.1 72.26,28.83 71.37,27.94 71.37,18.03 72.14,17.27 74.68,17.27 75.95,18.54 75.95,19.67 R23.1 | 56.13,144.53 50.29,144.53 | X1.1 57.4,145.8 56.13,144.53 | 56.13,144.53 56.39,144.27 v58.17,144.27
  Top 0.406: v65.02,144.27 67.82,144.27 71.5,140.59 72.52,140.59 | U2.1 U2.16 | U2.16 47.48,85.8 C21.1 47.64,87.15 R15.1 | R27.1 47.69,44.96 | 47.69,44.96 C1.1 47.75,42.86 47.75,41.15 48.32,40.58 U3.16 | U3.2 41.53,38.23 v40.64,39.12 40.64,40.64 44.96,44.96 47.69,44.96 | U2.16 51.44,83.95 v51.82,84.33 | 17.51,130.56 R5.1 21.13,117.98 22.15,116.97 22.15,108.76 20.83,107.44 18.17,107.44 17.41,108.2 | 71.37,84.58 71.63,84.33 75.2,84.33 75.96,85.09 | 21.34,40.64 18.17,40.64 17.41,41.4 | v21.08,39.12 21.08,40.39 21.34,40.64
  Bottom 0.406: v48.77,144.53 v33.27,144.53 | v50.29,133.86 v50.29,142.75 | v58.17,144.27 v65.02,144.27 | v51.82,84.33 v71.37,84.33 | v40.64,39.12 v21.08,39.12
VLASER
  Top 0.61: 32.81,126.49 32.81,138.05 36.83,142.06 X4.4 36.83,154.43 38.61,156.21 59.18,156.21 60.71,154.69 60.71,124.46 | 32.81,126.49 32.81,104.9 | 32.81,104.9 32.81,87.68 32.77,87.63 32.77,81.79 | 32.77,81.79 32.77,59.94 | 32.77,59.94 32.77,42.93 31.5,41.66 31.5,35.31 | 60.71,124.46 60.71,109.22 | 60.71,109.22 60.71,82.04 | 60.71,82.04 60.71,62.99 | 60.71,62.99 60.71,38.1 | 60.71,38.1 60.71,14.99 62.1,13.59 S23.2 | S16.2 61.85,125.6 60.71,124.46 | S13.2 31.92,125.6 32.81,126.49 | S15.2 31.67,103.76 32.81,104.9 | S14.2 62.1,107.82 60.71,109.22 | S18.2 31.62,80.64 32.77,81.79 | S17.2 62.1,80.64 60.71,82.04 | S19.2 62.1,61.59 60.71,62.99 | S24.2 31.37,14.6 32.77,16 32.77,34.04 31.5,35.31 | S21.2 62.36,36.45 60.71,38.1 | 31.5,35.31 30.1,33.91 S22.2 | S20.2 31.62,58.8 32.77,59.94
VTS  (via drill 0.7 pad 1.4)
  Top 0.406: X6.1 11.22,109.85 14.08,112.71 TS4.3 | 5.89,109.85 X6.1 | TS2.3 14.34,135.07 11.48,132.21 X3.1 v4.62,132.21 v4.62,136.78 | v4.62,142.87 7.03,145.29 24.38,145.29 25.91,146.81 v33.27,146.81 | X6.1 5.84,109.85 | 5.84,109.85 4.7,109.85 v4.57,109.73 | v4.62,111.38 4.62,111.08 5.84,109.85 | TS6.3 13.91,90.36 11.05,87.5 X8.1 5.97,87.5 v4.57,88.9 v4.57,87.12 | v4.57,67.31 5.33,66.55 | 5.33,66.55 6.73,65.15 X10.1 11.3,65.15 14.16,68.01 TS8.3 | X1.2 54.86,147.57 | 54.86,147.57 54.1,146.81 v48.77,146.81 | 5.33,66.55 4.57,65.79 v4.57,65.28 | v4.57,45.97 5.33,45.21 | 5.33,45.21 7.75,42.8 X12.1 11.3,42.8 14.16,45.66 TS10.3 | 5.33,45.21 4.57,44.45 v4.57,43.43 | v4.57,25.65 4.57,21.34 5.46,20.45 X14.1 11.3,20.45 14.16,23.31 TS12.3 | TS1.3 79.31,136.97 82.17,139.83 X2.1 87.25,139.83 88.39,138.68 | 88.39,138.68 88.9,138.18 v88.9,136.14 | 88.52,117.47 X5.1 82.17,117.47 79.31,114.61 TS3.3 | 88.52,117.47 v88.9,117.86 | 88.52,117.47 88.52,116.2 v88.9,115.82 | TS5.3 79.31,92.26 82.17,95.12 X7.1 88.77,95.12 | v88.9,95.25 88.77,95.12 | 88.77,95.12 88.9,95 v88.9,93.22 | v88.9,73.15 88.52,72.77 | 88.52,72.77 X9.1 81.92,72.77 79.06,69.91 TS7.3 | 88.52,72.77 88.9,72.39 v88.9,70.87 | v88.9,50.8 88.52,50.42 | 88.52,50.42 X11.1 81.92,50.42 79.06,47.56 TS9.3 | 88.52,50.42 88.9,50.04 v88.9,48.51 | v88.9,28.96 88.01,28.07 X13.1 81.92,28.07 79.06,25.21 TS11.3 | 54.86,147.57 55.63,146.81 v55.63,146.3 | 88.39,138.68 88.9,139.19 v88.9,140.21 | v88.9,144.27 86.87,146.3 v65.02,146.3
  Bottom 0.406: v4.62,132.21 v4.62,111.38 | v4.62,136.78 v4.62,142.87 | v4.57,109.73 v4.57,88.9 | v4.57,87.12 v4.57,67.31 | v48.77,146.81 v33.27,146.81 | v4.57,65.28 v4.57,45.97 | v4.57,43.43 v4.57,25.65 | v88.9,136.14 v88.9,117.86 | v88.9,115.82 v88.9,95.25 | v88.9,93.22 v88.9,73.15 | v88.9,70.87 v88.9,50.8 | v88.9,48.51 v88.9,28.96 | v88.9,140.21 v88.9,144.27 | v65.02,146.3 v55.63,146.3

### Text on the board
tPlace: Signals | Power | TH1 | TH0 | LH1 | LH0 | S0 | S1 | TH3 | TH2 | LH3 | LH2 | S2 | S3 | TH5 | TH4 | LH5 | LH4 | S5 | S4 | TH7 | TH6 | LH7 | LH6 | S6 | S7 | TH8 | TH9 | LH9 | LH8 | S8 | S9 | TH11 | TH10 | LH10 | LH11 | S11 | S10 | Temperature Sensor Board V1.2. | Terawatt Productions Inc. Oct 10, 2018.